# EAGLE design strip (EAGLE 6.4)

## Sheet 1 of 2
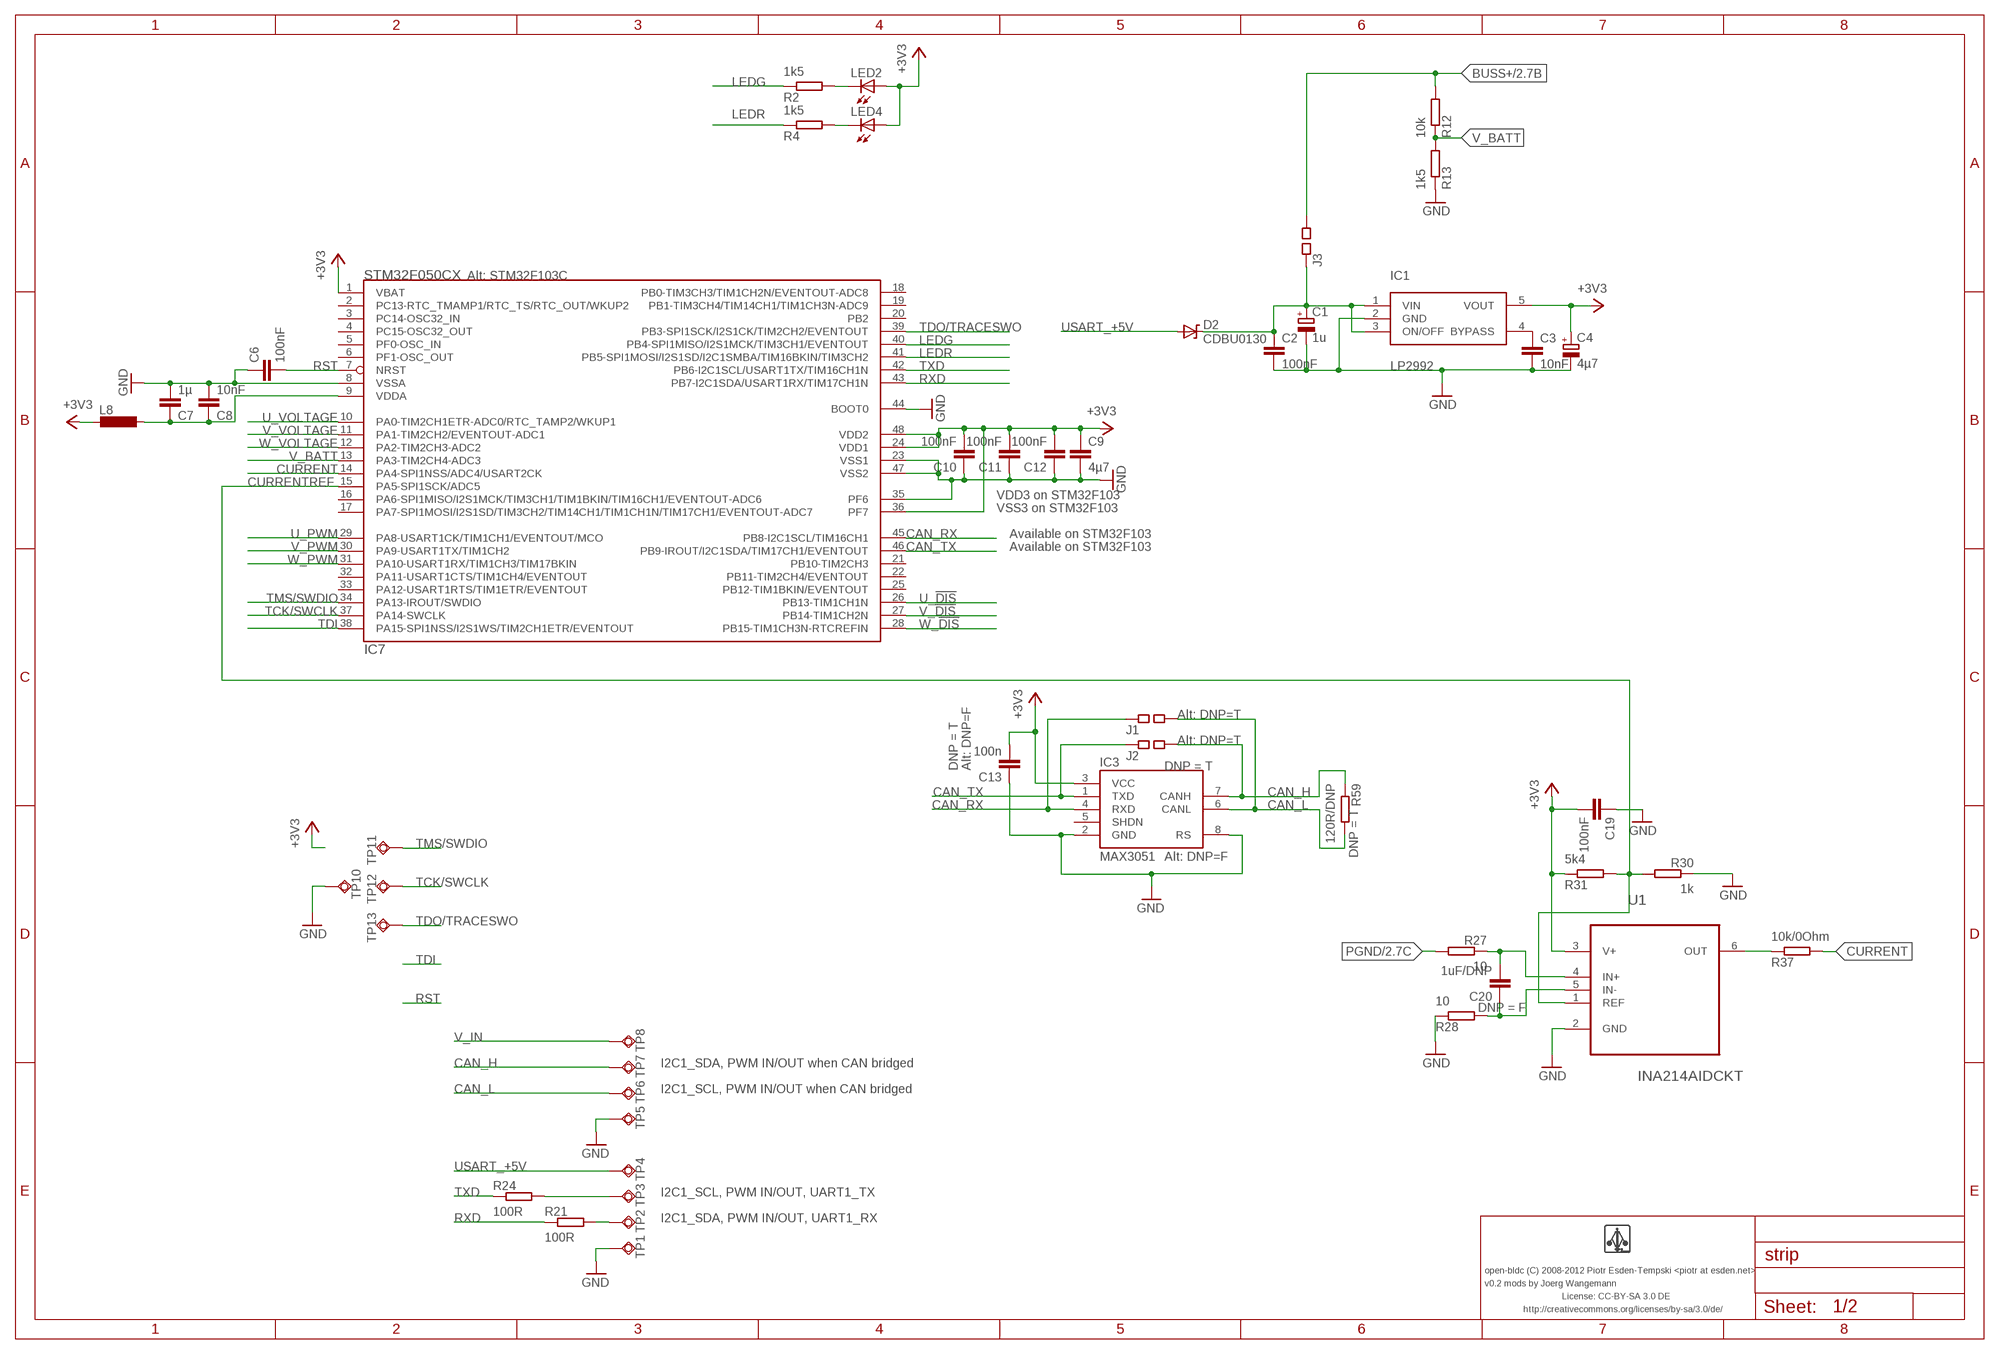
[diagram p0: schematic, sheet 1]

### Parts
C1  1u  CAPACITOR-POL-0805  [0805-POL-CAP]
C2  100nF  CAPACITOR-0402  [0402-CAP]
C3  10nF  CAPACITOR-0402  [0402-CAP]
C4  4µ7  CAPACITOR-POL-0805  [0805-POL-CAP]
C6  100nF  CAPACITOR-0402  [0402-CAP]
C7  1µ  CAPACITOR-0402  [0402-CAP]
C8  10nF  CAPACITOR-0402  [0402-CAP]
C9  4µ7  CAPACITOR-0805  [0805-CAP]
C10  100nF  CAPACITOR-0402  [0402-CAP]
C11  100nF  CAPACITOR-0402  [0402-CAP]
C12  100nF  CAPACITOR-0402  [0402-CAP]
C13  100n  CAPACITOR-0402  [0402-CAP]
C19  100nF  CAPACITOR-0402  [0402-CAP]
C20  1uF/DNP  CAPACITOR-0603  [0603-CAP]
D2  CDBU0130  DIODE-ZENER-0603  [0603-DIO]
IC1  LP2992  [SOT23-5]
IC3  MAX3051  [SO8]
IC7  STM32F050CX  [LQFP48]
J1  SQ_JMP-0402  [0402-SQJMP]
J2  SQ_JMP-0402  [0402-SQJMP]
J3  SQ_JMP-0402  [0402-SQJMP]
L8  INDUCTOR-0603  [0603-IND]
LED2  GREEN  LED-0402  [0402-LED]
LED4  RED  LED-0402  [0402-LED]
R2  1k5  RESISTOR-0402  [0402-RES]
R4  1k5  RESISTOR-0402  [0402-RES]
R12  10k  RESISTOR-0402  [0402-RES]
R13  1k5  RESISTOR-0402  [0402-RES]
R21  100R  RESISTOR-0402  [0402-RES]
R24  100R  RESISTOR-0402  [0402-RES]
R27  10  RESISTOR-0402  [0402-RES]
R28  10  RESISTOR-0402  [0402-RES]
R30  1k  RESISTOR-0402  [0402-RES]
R31  5k4  RESISTOR-0402  [0402-RES]
R37  10k/0Ohm  RESISTOR-0402  [0402-RES]
R59  120R/DNP  RESISTOR-0402  [0402-RES]
TP1  TPSQTP20SQ  [TP20SQ]
TP2  TPSQTP20SQ  [TP20SQ]
TP3  TPSQTP20SQ  [TP20SQ]
TP4  TPSQTP20SQ  [TP20SQ]
TP5  TPSQTP20SQ  [TP20SQ]
TP6  TPSQTP20SQ  [TP20SQ]
TP7  TPSQTP20SQ  [TP20SQ]
TP8  TPSQTP20SQ  [TP20SQ]
TP10  TPSQTP11SQ  [TP11SQ]
TP11  TPSQTP11SQ  [TP11SQ]
TP12  TPSQTP11SQ  [TP11SQ]
TP13  TPSQTP11SQ  [TP11SQ]
U1  INA214AIDCKT  [SOT65P210X110-6N]
U$1  LOGO  LOGO-SILK-SMALL  [LOGO_SILK_SMALL]

### Nets
+3V3: C4.+ C9.P$1 C10.P$2 C11.P$2 C12.P$2 C13.P$2 C19.P$2 IC1.5(VOUT) IC3.3(VCC) IC7.1(VBAT) IC7.24(VDD1) IC7.36(PF7) IC7.48(VDD2) L8.P$2 LED2.A LED4.A R31.P$1 U1.3(V+)
BUSS+: J3.P$2 R12.P$2 ; also sheet 2
CAN_H: IC3.7(CANH) J2.P$2 R59.P$1 TP7.TP
CAN_L: IC3.6(CANL) J1.P$2 R59.P$2 TP6.TP
CAN_RX: IC3.4(RXD) IC7.45(PB8-I2C1SCL/TIM16CH1) J1.P$1
CAN_TX: IC3.1(TXD) IC7.46(PB9-IROUT/I2C1SDA/TIM17CH1/EVENTOUT) J2.P$1
CURRENT: IC7.14(PA4-SPI1NSS/ADC4/USART2CK) R37.P$2
CURRENT_RAW: R37.P$1 U1.6(OUT)
CURRENTREF: IC7.15(PA5-SPI1SCK/ADC5) R30.P$2 R31.P$2 U1.1(REF)
GND: C1.- C2.P$2 C3.P$2 C4.- C6.P$1 C7.P$2 C8.P$2 C9.P$2 C10.P$1 C11.P$1 C12.P$1 C13.P$1 C19.P$1 IC1.2(GND) IC3.2(GND) IC3.8(RS) IC7.8(VSSA) IC7.23(VSS1) IC7.35(PF6) IC7.44(BOOT0) IC7.47(VSS2) R13.P$1 R28.P$1 R30.P$1 TP1.TP TP5.TP TP10.TP U1.2(GND) ; also sheet 2
INA21_INN: C20.P$1 R28.P$2 U1.5(IN-)
INA21_INP: C20.P$2 R27.P$1 U1.4(IN+)
LEDG: IC7.40(PB4-SPI1MISO/I2S1MCK/TIM3CH1/EVENTOUT) R2.P$1
LEDR: IC7.41(PB5-SPI1MOSI/I2S1SD/I2C1SMBA/TIM16BKIN/TIM3CH2) R4.P$1
N$4: LED4.C R4.P$2
N$6: R21.P$2 TP2.TP
N$10: LED2.C R2.P$2
N$20: R24.P$2 TP3.TP
N$22: C3.P$1 IC1.4(BYPASS)
PGND: R27.P$2 ; also sheet 2
RST: C6.P$2 IC7.7(NRST)
RXD: IC7.43(PB7-I2C1SDA/USART1RX/TIM17CH1N) R21.P$1
TCK/SWCLK: IC7.37(PA14-SWCLK) TP12.TP
TDI: IC7.38(PA15-SPI1NSS/I2S1WS/TIM2CH1ETR/EVENTOUT)
TDO/TRACESWO: IC7.39(PB3-SPI1SCK/I2S1CK/TIM2CH2/EVENTOUT) TP13.TP
TMS/SWDIO: IC7.34(PA13-IROUT/SWDIO) TP11.TP
TXD: IC7.42(PB6-I2C1SCL/USART1TX/TIM16CH1N) R24.P$1
U_!DIS: IC7.26(PB13-TIM1CH1N) ; also sheet 2
U_PWM: IC7.29(PA8-USART1CK/TIM1CH1/EVENTOUT/MCO) ; also sheet 2
U_VOLTAGE: IC7.10(PA0-TIM2CH1ETR-ADC0/RTC_TAMP2/WKUP1) ; also sheet 2
USART_+5V: D2.A TP4.TP
V_!DIS: IC7.27(PB14-TIM1CH2N) ; also sheet 2
V_BATT: IC7.13(PA3-TIM2CH4-ADC3) R12.P$1 R13.P$2
V_IN: C1.+ C2.P$1 D2.C IC1.1(VIN) IC1.3(ON/OFF) J3.P$1 TP8.TP
V_PWM: IC7.30(PA9-USART1TX/TIM1CH2) ; also sheet 2
V_VOLTAGE: IC7.11(PA1-TIM2CH2/EVENTOUT-ADC1) ; also sheet 2
VDDA: C7.P$1 C8.P$1 IC7.9(VDDA) L8.P$1
W_!DIS: IC7.28(PB15-TIM1CH3N-RTCREFIN) ; also sheet 2
W_PWM: IC7.31(PA10-USART1RX/TIM1CH3/TIM17BKIN) ; also sheet 2
W_VOLTAGE: IC7.12(PA2-TIM2CH3-ADC2) ; also sheet 2
Unconnected: IC3.5(SHDN) IC7.2(PC13-RTC_TMAMP1/RTC_TS/RTC_OUT/WKUP2) IC7.3(PC14-OSC32_IN) IC7.4(PC15-OSC32_OUT) IC7.5(PF0-OSC_IN) IC7.6(PF1-OSC_OUT) IC7.16(PA6-SPI1MISO/I2S1MCK/TIM3CH1/TIM1BKIN/TIM16CH1/EVENTOUT-ADC6) IC7.17(PA7-SPI1MOSI/I2S1SD/TIM3CH2/TIM14CH1/TIM1CH1N/TIM17CH1/EVENTOUT-ADC7) IC7.18(PB0-TIM3CH3/TIM1CH2N/EVENTOUT-ADC8) IC7.19(PB1-TIM3CH4/TIM14CH1/TIM1CH3N-ADC9) IC7.20(PB2) IC7.21(PB10-TIM2CH3) IC7.22(PB11-TIM2CH4/EVENTOUT) IC7.25(PB12-TIM1BKIN/EVENTOUT) IC7.32(PA11-USART1CTS/TIM1CH4/EVENTOUT) IC7.33(PA12-USART1RTS/TIM1ETR/EVENTOUT)

### Notes on the sheet
- Alt: STM32F103C
- VDD3 on STM32F103
- VSS3 on STM32F103
- Available on STM32F103
- Available on STM32F103
- Alt: DNP=T
- Alt: DNP=T
- Alt: DNP=F
- Alt: DNP=F
- I2C1_SDA, PWM IN/OUT when CAN bridged
- I2C1_SCL, PWM IN/OUT when CAN bridged
- I2C1_SCL, PWM IN/OUT, UART1_TX
- I2C1_SDA, PWM IN/OUT, UART1_RX
- open-bldc (C) 2008-2012 Piotr Esden-Tempski <piotr at esden.net>
- v0.2 mods by Joerg Wangemann
- License: CC-BY-SA 3.0 DE
- http://creativecommons.org/licenses/by-sa/3.0/de/

## Sheet 2 of 2
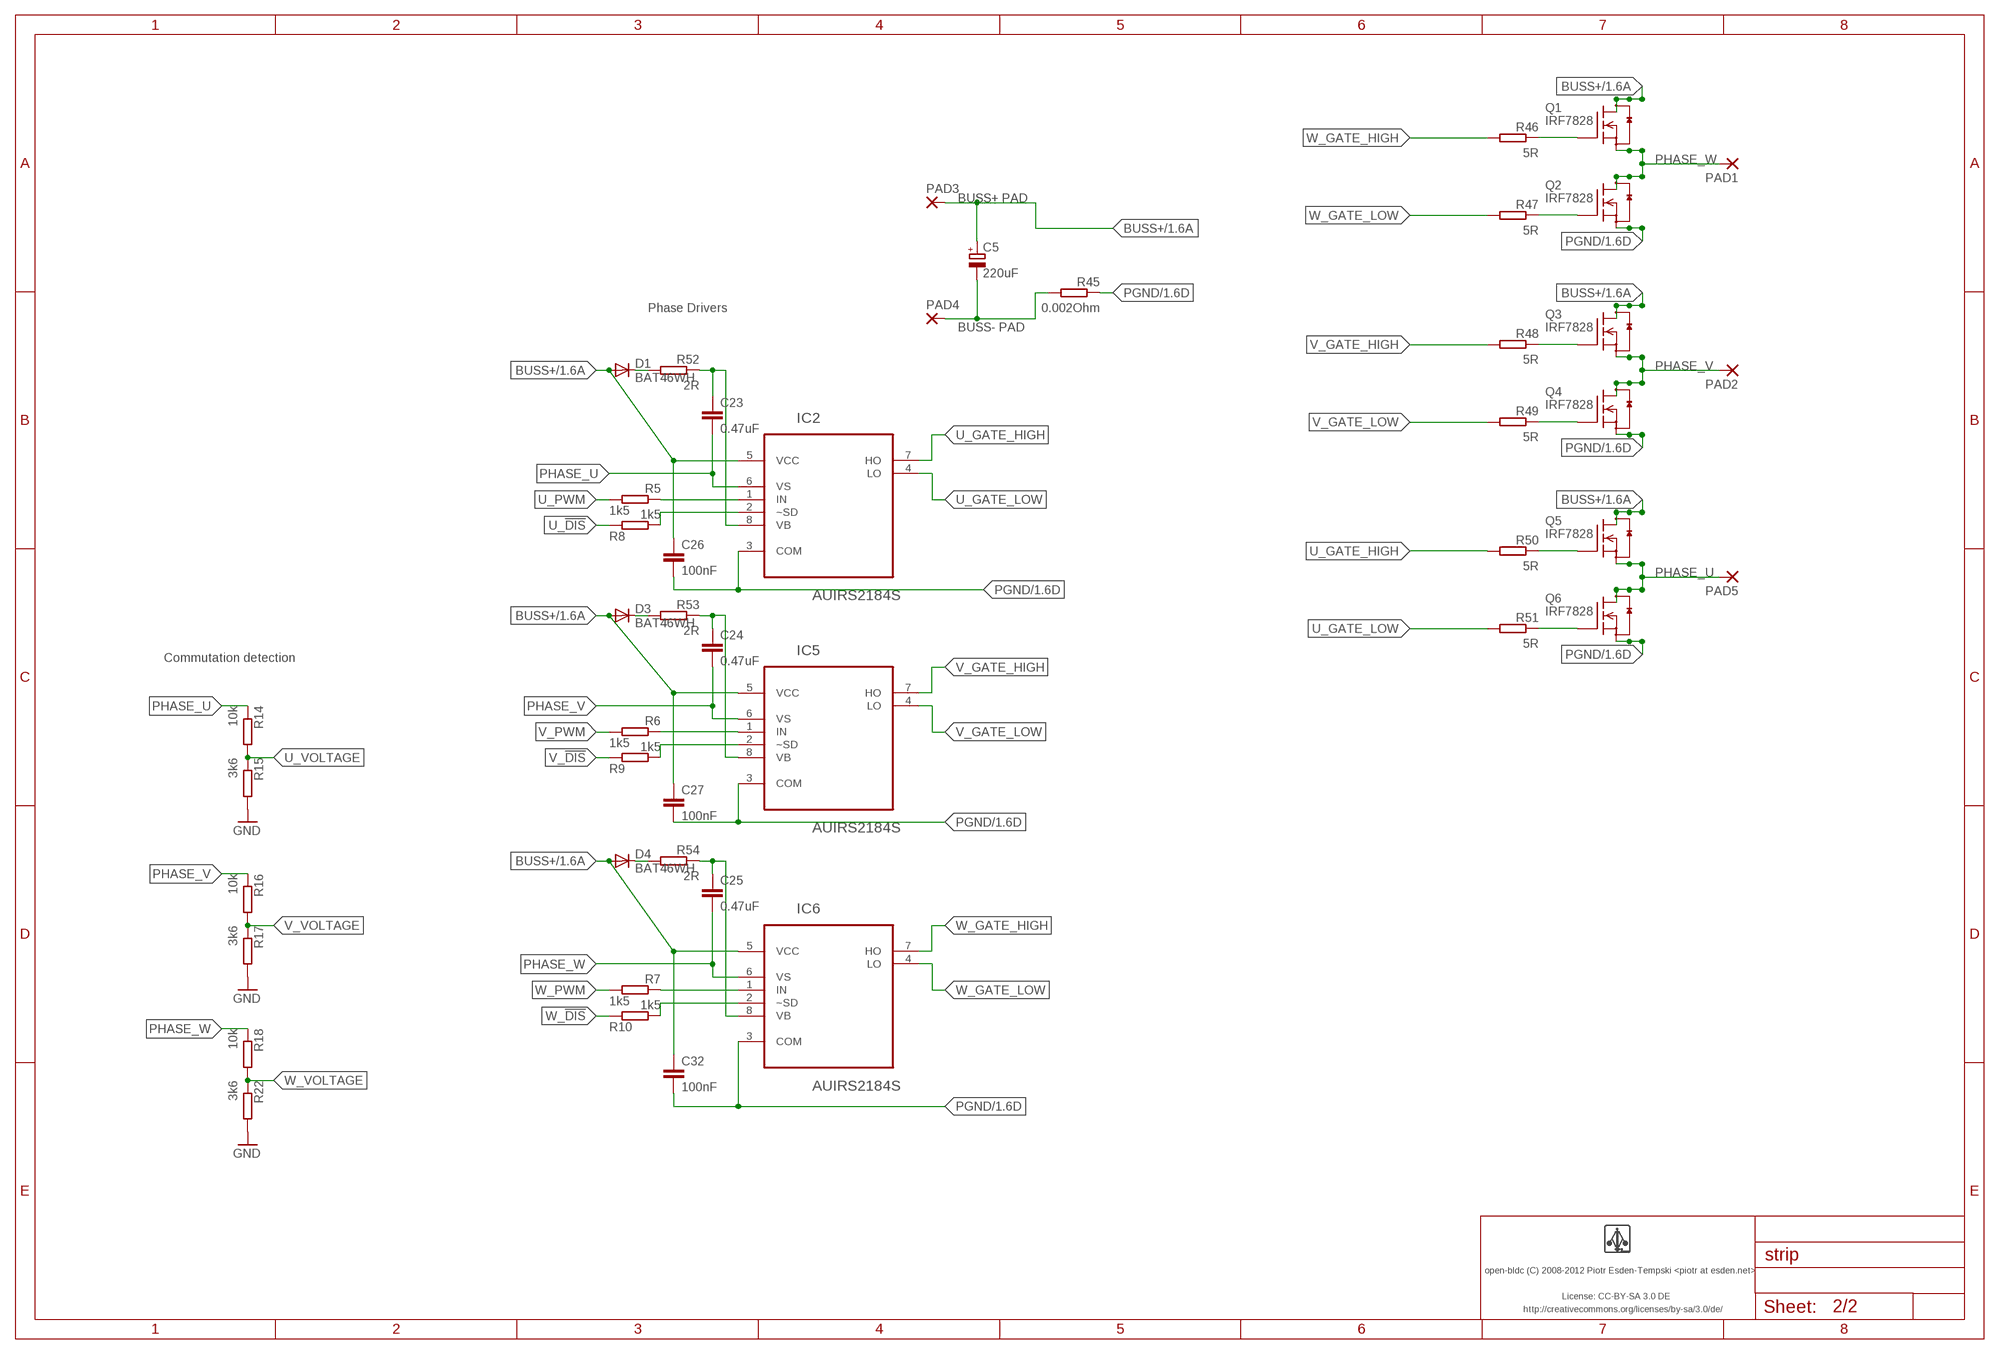
[diagram p1: schematic, sheet 2]

### Parts
C5  220uF  CAPACITOR-POLD  [7343/D]
C23  0.47uF  CAPACITOR-0603  [0603-CAP]
C24  0.47uF  CAPACITOR-0603  [0603-CAP]
C25  0.47uF  CAPACITOR-0603  [0603-CAP]
C26  100nF  CAPACITOR-0603  [0603-CAP]
C27  100nF  CAPACITOR-0603  [0603-CAP]
C32  100nF  CAPACITOR-0603  [0603-CAP]
D1  BAT46WH  DIODE-SOD-123  [SOD-123-DIO]
D3  BAT46WH  DIODE-SOD-123  [SOD-123-DIO]
D4  BAT46WH  DIODE-SOD-123  [SOD-123-DIO]
IC2  AUIRS2184S  [SOIC127P600X175-8N]
IC5  AUIRS2184S  [SOIC127P600X175-8N]
IC6  AUIRS2184S  [SOIC127P600X175-8N]
PAD1  SMD5  [SMD2,54-5,08]
PAD2  SMD5  [SMD2,54-5,08]
PAD3  SMD5  [SMD2,54-5,08]
PAD4  SMD5  [SMD2,54-5,08]
PAD5  SMD5  [SMD2,54-5,08]
Q1  IRF7828  [SO8]
Q2  IRF7828  [SO8]
Q3  IRF7828  [SO8]
Q4  IRF7828  [SO8]
Q5  IRF7828  [SO8]
Q6  IRF7828  [SO8]
R5  1k5  RESISTOR-0402  [0402-RES]
R6  1k5  RESISTOR-0402  [0402-RES]
R7  1k5  RESISTOR-0402  [0402-RES]
R8  1k5  RESISTOR-0402  [0402-RES]
R9  1k5  RESISTOR-0402  [0402-RES]
R10  1k5  RESISTOR-0402  [0402-RES]
R14  10k  RESISTOR-0402  [0402-RES]
R15  3k6  RESISTOR-0402  [0402-RES]
R16  10k  RESISTOR-0402  [0402-RES]
R17  3k6  RESISTOR-0402  [0402-RES]
R18  10k  RESISTOR-0402  [0402-RES]
R22  3k6  RESISTOR-0402  [0402-RES]
R45  0.002Ohm  RESISTOR-1206  [1206-RES]
R46  5R  RESISTOR-0603  [0603-RES]
R47  5R  RESISTOR-0603  [0603-RES]
R48  5R  RESISTOR-0603  [0603-RES]
R49  5R  RESISTOR-0603  [0603-RES]
R50  5R  RESISTOR-0603  [0603-RES]
R51  5R  RESISTOR-0603  [0603-RES]
R52  2R  RESISTOR-0402  [0402-RES]
R53  2R  RESISTOR-0402  [0402-RES]
R54  2R  RESISTOR-0402  [0402-RES]
U$2  LOGO  LOGO-SILK-SMALL  [LOGO_SILK_SMALL]

### Nets
BUSS+: C5.+ C26.P$1 C27.P$1 C32.P$1 D1.A D3.A D4.A IC2.5(VCC) IC5.5(VCC) IC6.5(VCC) PAD3.1(P) Q1.5(D1) Q1.6(D2) Q1.7(D3) Q1.8(D4) Q3.5(D1) Q3.6(D2) Q3.7(D3) Q3.8(D4) Q5.5(D1) Q5.6(D2) Q5.7(D3) Q5.8(D4) ; also sheet 1
GND: C5.- PAD4.1(P) R15.P$2 R17.P$2 R22.P$2 R45.P$2 ; also sheet 1
N$1: D1.C R52.P$2
N$2: D4.C R54.P$2
N$3: D3.C R53.P$2
PGND: C26.P$2 C27.P$2 C32.P$2 IC2.3(COM) IC5.3(COM) IC6.3(COM) Q2.1(S3) Q2.2(S2) Q2.3(S1) Q4.1(S3) Q4.2(S2) Q4.3(S1) Q6.1(S3) Q6.2(S2) Q6.3(S1) R45.P$1 ; also sheet 1
PHASE_U: C23.P$2 IC2.6(VS) PAD5.1(P) Q5.1(S3) Q5.2(S2) Q5.3(S1) Q6.5(D1) Q6.6(D2) Q6.7(D3) Q6.8(D4) R14.P$1
PHASE_V: C24.P$2 IC5.6(VS) PAD2.1(P) Q3.1(S3) Q3.2(S2) Q3.3(S1) Q4.5(D1) Q4.6(D2) Q4.7(D3) Q4.8(D4) R16.P$1
PHASE_W: C25.P$2 IC6.6(VS) PAD1.1(P) Q1.1(S3) Q1.2(S2) Q1.3(S1) Q2.5(D1) Q2.6(D2) Q2.7(D3) Q2.8(D4) R18.P$1
U_!DIS: R8.P$1 ; also sheet 1
U_GATE_HIGH: IC2.7(HO) R50.P$2
U_GATE_HIGH_T: Q5.4(G) R50.P$1
U_GATE_LOW: IC2.4(LO) R51.P$2
U_GATE_LOW_T: Q6.4(G) R51.P$1
U_PWM: R5.P$2 ; also sheet 1
U_PWM_IN: IC2.1(IN) R5.P$1
U_SD: IC2.2(~SD) R8.P$2
U_VB: C23.P$1 IC2.8(VB) R52.P$1
U_VOLTAGE: R14.P$2 R15.P$1 ; also sheet 1
V_!DIS: R9.P$1 ; also sheet 1
V_GATE_HIGH: IC5.7(HO) R48.P$2
V_GATE_HIGH_T: Q3.4(G) R48.P$1
V_GATE_LOW: IC5.4(LO) R49.P$2
V_GATE_LOW_T: Q4.4(G) R49.P$1
V_PWM: R6.P$2 ; also sheet 1
V_PWM_IN: IC5.1(IN) R6.P$1
V_SD: IC5.2(~SD) R9.P$2
V_VB: C24.P$1 IC5.8(VB) R53.P$1
V_VOLTAGE: R16.P$2 R17.P$1 ; also sheet 1
W_!DIS: R10.P$1 ; also sheet 1
W_GATE_HIGH: IC6.7(HO) R46.P$2
W_GATE_HIGH_T: Q1.4(G) R46.P$1
W_GATE_LOW: IC6.4(LO) R47.P$2
W_GATE_LOW_T: Q2.4(G) R47.P$1
W_PWM: R7.P$2 ; also sheet 1
W_PWM_IN: IC6.1(IN) R7.P$1
W_SD: IC6.2(~SD) R10.P$2
W_VB: C25.P$1 IC6.8(VB) R54.P$1
W_VOLTAGE: R18.P$2 R22.P$1 ; also sheet 1

### Notes on the sheet
- BUSS+ PAD
- Phase Drivers
- BUSS- PAD
- Commutation detection
- open-bldc (C) 2008-2012 Piotr Esden-Tempski <piotr at esden.net>
- License: CC-BY-SA 3.0 DE
- http://creativecommons.org/licenses/by-sa/3.0/de/

## Library data of the parts
C1 = pel_dipol_comp:CAPACITOR-POL; PARTNO: cap-cer-0805-1u-35v
C2 C6 C10-C12 C19 C26 C27 C32 = pel_dipol_comp:CAPACITOR; PARTNO: cap-cer-0402-100n
C3 C8 = pel_dipol_comp:CAPACITOR; PARTNO: cap-cer-0402-10n
C4 = pel_dipol_comp:CAPACITOR-POL; PARTNO: cap-cer-0805-4u7-16v
C5 = pel_dipol_comp:CAPACITOR-POL; PARTNO: cap-tan-D-220u-16v
C7 = pel_dipol_comp:CAPACITOR; PARTNO: cap-cer-0402-1u
C9 = pel_dipol_comp:CAPACITOR; PARTNO: cap-cer-0805-4u7
C13 = pel_dipol_comp:CAPACITOR; DNP: T; PARTNO: cap-cer-0402-100n
C20 = pel_dipol_comp:CAPACITOR; DNP: F; PARTNO: cap-cer-0402-100n
C23-C25 = pel_dipol_comp:CAPACITOR; PARTNO: cap-tan-0603-1u
D1 D3 D4 = pel_dipol_comp:DIODE; PARTNO: *
D2 = pel_dipol_comp:DIODE-ZENER; PARTNO: diode-0603
IC1 = open-bldc:LP2992; PARTNO: vreg-sot-23-5-3v3
IC2 IC5 IC6 = auris2184s:AUIRS2184S: HALF-BRIDGE DRIVER; MPN: AUIRS2184S; OC_FARNELL: 1866062; OC_NEWARK: 39T4040; PACKAGE: SOIC-8; PARTNO: ic-so8-mosfet-driver-buck; SUPPLIER: INTERNATIONAL RECTIFIER
IC3 = open-bldc:MAX3051; DNP: T; PARTNO: *
IC7 = pel_stm32:STM32F050CX; PARTNO: mcu-tqfp-32-stm32f05
J1-J3 = pel_jumpers:SQ_JMP; PARTNO: res-0402-0
L8 = res_cap:INDUCTOR; PARTNO: ferrite-0603-600ohm
LED2 LED4 = pel_dipol_comp:LED; PARTNO: led-0402-green
PAD1-PAD5 = wirepad:SMD5: SMD PAD; PARTNO: *
Q1-Q6 = open-bldc:IRF7828; PARTNO: ic-so8-mosfet-n-ch-30v-15a
R2 R4-R10 R13 = pel_dipol_comp:RESISTOR; PARTNO: res-0402-1k5
R12 R14 R16 R18 = pel_dipol_comp:RESISTOR; PARTNO: res-0402-10k
R15 R17 R22 = pel_dipol_comp:RESISTOR; PARTNO: *
R21 R24 = pel_dipol_comp:RESISTOR; PARTNO: res-0402-100
R27 = pel_dipol_comp:RESISTOR; PARTNO: res-0402-665
R28 = pel_dipol_comp:RESISTOR; PARTNO: res-0402-560
R30 = pel_dipol_comp:RESISTOR; PARTNO: res-0402-1k
R31 = pel_dipol_comp:RESISTOR; PARTNO: res-0402-5k36
R37 = pel_dipol_comp:RESISTOR; PARTNO: res-0402-0
R45 = pel_dipol_comp:RESISTOR; PARTNO: res-1206-0005
R46-R54 = pel_dipol_comp:RESISTOR; PARTNO: res-0402-10
R59 = pel_dipol_comp:RESISTOR; DNP: T; PARTNO: res-0402-60.4
TP1-TP8 TP10-TP13 = testpad:TPSQ: Test pad; DNP: T; PARTNO: *
U1 = open-bldc:INA214AIDCKT: CURRENT SHUNT MONITOR; MPN: INA214AIDCKT; OC_FARNELL: 1754262; OC_NEWARK: 05N1041; PACKAGE: SC-70-6; SUPPLIER: Texas Instruments
U$1 U$2 = open-bldc:LOGO; PARTNO: *

## Board
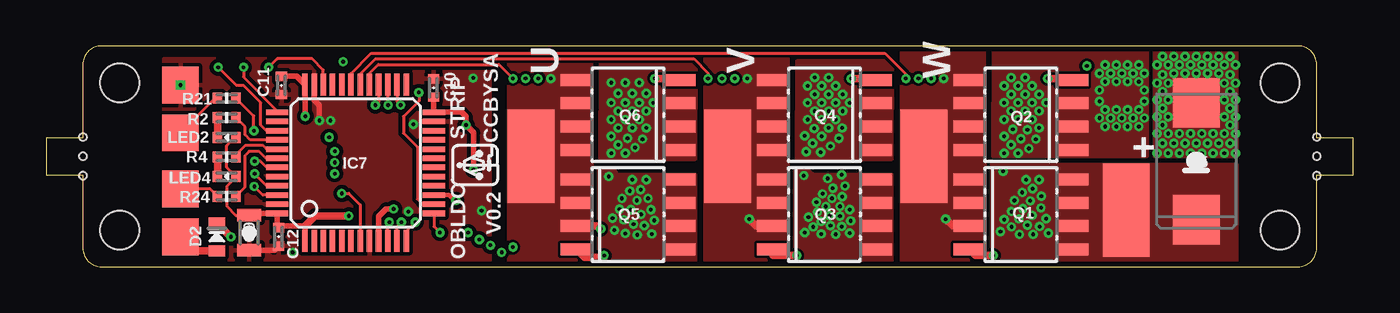
[diagram p2: board, top side]
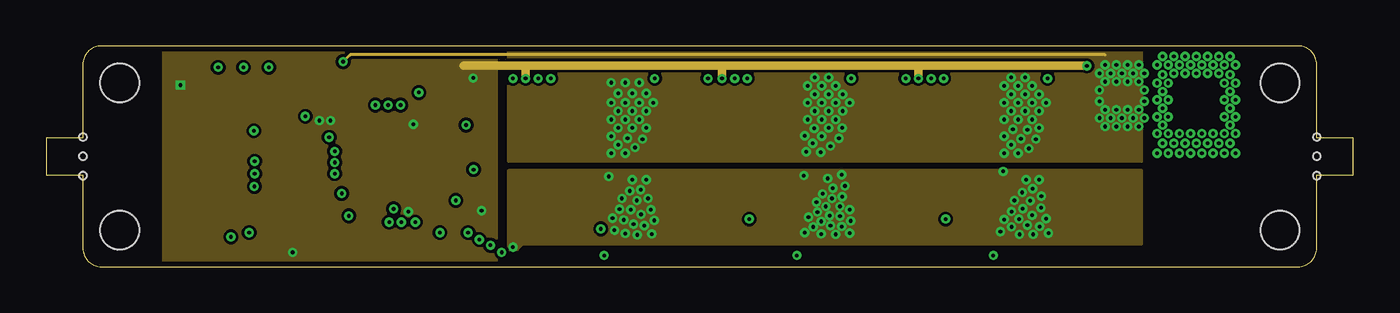
[diagram p3: board, inner layer Route2]
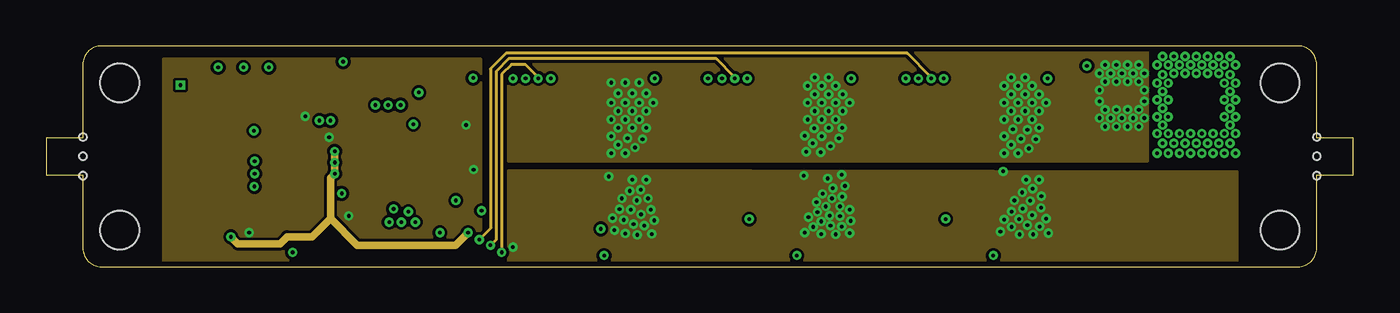
[diagram p4: board, inner layer Route15]
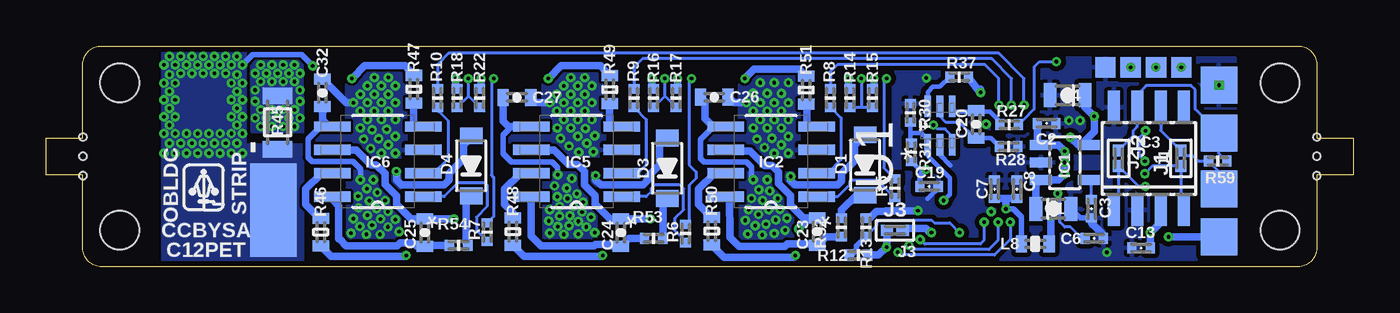
[diagram p5: board, bottom side, seen from below]

Size 71 x 12 mm. Coordinates in mm from the lower left corner, seen from the top.
Outline: 2,1 arc90 3,0 68,0 arc90 69,1 69,5 71,5 71,7 69,7 69,11 arc90 68,12 3,12 arc90 2,11 2,7 0,7 0,5 2,5 2,1
Copper layers (1+2*15+16): Top 0.035mm / dielectric 0.36mm / Route2 0.035mm / dielectric 0.71mm / Route15 0.035mm / dielectric 0.36mm / Bottom 0.035mm
Design rules "LeitOn - Standard-Eagle-DRU - 4-Lagen Multilayer - deutsch - Rev 2.0 *": minimum track width 0.15mm, minimum drill 0.2mm, track to track 0.15mm, track to pad 0.15mm, pad to pad 0.15mm, via to via 0.15mm, smd to smd 0.15mm, copper to edge 0.3mm, drill to drill 0.3mm, minimum pad ring 0.15mm, minimum via ring 0.15mm, stop-mask expansion 0.075mm, vias tented up to drill 0mil, thermal gap 0.2mm
Holes 2.1 mm at 67,2 4,10 67,10 4,2
Holes 0.4 mm at 69,6 69,7.05 69,4.95 2,4.95 2,6 2,7.05
bRestrict: area 29.6,21.1 to 29.9,21.1; area 25.8,21 to 26.1,21

### Footprints (pad centres in the part's own frame; a part is rotated, then mirrored left to right if it is on the bottom)
0805-POL-CAP = smd 0.7 x 1.3: + -0.95,0; - 0.95,0
0402-CAP = smd 0.5 x 0.6: P$1 -0.5,0; P$2 0.5,0
7343/D = smd 2.7 x 2.55: + -3.175,0; - 3.175,0
0805-CAP = smd 0.7 x 1.3: P$1 -0.95,0; P$2 0.95,0
0603-CAP = smd 0.6 x 0.9: P$1 -0.75,0; P$2 0.75,0
SOD-123-DIO = smd 0.91 x 1.22: A 1.64,0; C -1.64,0
0603-DIO = smd 0.6 x 0.9: A 0.75,0; C -0.75,0
SOT23-5 = smd 0.55 x 1.2: 1 -0.95,-1.3; 2 0,-1.3; 3 0.95,-1.3; 4 0.95,1.3; 5 -0.95,1.3
SOIC127P600X175-8N = smd 1.981 x 0.559: 1 -2.464,1.905; 2 -2.464,0.635; 3 -2.464,-0.635; 4 -2.464,-1.905; 5 2.464,-1.905; 6 2.464,-0.635; 7 2.464,0.635; 8 2.464,1.905
SO8 = smd 0.65 x 1.75: 1 -1.905,-2.8; 2 -0.635,-2.8; 3 0.635,-2.8; 4 1.905,-2.8; 5 1.905,2.8; 6 0.635,2.8; 7 -0.635,2.8; 8 -1.905,2.8
LQFP48 = smd 0.3 x 1.2: 1 -2.75,-4.25; 2 -2.25,-4.25; 3 -1.75,-4.25; 4 -1.25,-4.25; 5 -0.75,-4.25; 6 -0.25,-4.25; 7 0.25,-4.25; 8 0.75,-4.25; 9 1.25,-4.25; 10 1.75,-4.25; 11 2.25,-4.25; 12 2.75,-4.25; 25 2.75,4.25; 26 2.25,4.25; 27 1.75,4.25; 28 1.25,4.25; 29 0.75,4.25; 30 0.25,4.25; 31 -0.25,4.25; 32 -0.75,4.25; 33 -1.25,4.25; 34 -1.75,4.25; 35 -2.25,4.25; 36 -2.75,4.25 | smd 1.2 x 0.3: 13 4.25,-2.75; 14 4.25,-2.25; 15 4.25,-1.75; 16 4.25,-1.25; 17 4.25,-0.75; 18 4.25,-0.25; 19 4.25,0.25; 20 4.25,0.75; 21 4.25,1.25; 22 4.25,1.75; 23 4.25,2.25; 24 4.25,2.75; 37 -4.25,2.75; 38 -4.25,2.25; 39 -4.25,1.75; 40 -4.25,1.25; 41 -4.25,0.75; 42 -4.25,0.25; 43 -4.25,-0.25; 44 -4.25,-0.75; 45 -4.25,-1.25; 46 -4.25,-1.75; 47 -4.25,-2.25; 48 -4.25,-2.75
0402-SQJMP = smd 0.652 x 0.6: P$1 -0.424,0; P$2 0.424,0
0603-IND = smd 0.6 x 0.9: P$1 -0.75,0; P$2 0.75,0
0402-LED = smd 0.5 x 0.6: A 0.5,0; C -0.5,0
SMD2,54-5,08 = smd 2.54 x 5.08: 1 0,0
0402-RES = smd 0.5 x 0.6: P$1 -0.5,0; P$2 0.5,0
1206-RES = smd 0.9 x 1.6: P$1 -1.45,0; P$2 1.45,0
0603-RES = smd 0.6 x 0.9: P$1 -0.75,0; P$2 0.75,0
TP20SQ = smd 2 x 2: TP 0,0
TP11SQ = smd 1.1 x 1.1: TP 0,0
SOT65P210X110-6N = smd 1.168 x 0.356: 1 -1.041,0.66; 2 -1.041,0; 3 -1.041,-0.66; 4 1.041,-0.66; 5 1.041,0; 6 1.041,0.66

### Placement (x,y rotation side)
C1  16.29,3.15 0 bottom
C2  16.67,7.79 0 bottom
C3  14.23,3.15 270 bottom
C4  15.53,9.32 180 bottom
C5  62.46,5.74 90 top
C6  14.08,1.55 180 bottom
C7  19.49,4.21 90 bottom
C8  18.27,4.21 90 bottom
C9  11.03,1.85 270 top
C10  21.04,9.72 270 top
C11  12.78,9.85 90 top
C12  12.63,1.62 90 top
C13  11.54,1.01 0 bottom
C19  23.05,4.37 180 bottom
C20  20.5,7.75 90 bottom
C23  29.11,1.91 90 bottom
C24  39.78,1.86 90 bottom
C25  50.42,1.86 90 bottom
C26  34.71,9.22 0 bottom
C27  45.42,9.19 0 bottom
C32  55.99,9.44 90 bottom
D1  26.52,5.53 90 bottom
D2  9.28,1.62 270 top
D3  37.27,5.36 90 bottom
D4  47.91,5.48 90 bottom
IC1  15.68,5.66 270 bottom
IC2  31.62,5.71 180 bottom
IC3  11.11,5.89 0 bottom
IC5  42.19,5.71 180 bottom
IC6  52.99,5.71 180 bottom
IC7  16.81,5.65 0 top
J1  9.38,5.89 90 bottom
J2  12.76,5.89 90 bottom
J3  24.9,1.98 180 bottom
L8  17.28,1.24 0 bottom
LED2  9.81,7.03 0 top
LED4  9.81,4.9 0 top
PAD1  47.68,6 180 top
PAD2  37.01,6 180 top
PAD3  58.65,3.07 180 top
PAD4  58.65,3.07 0 bottom
PAD5  26.35,6 180 top
Q1  52.94,2.84 270 top
Q2  52.94,8.25 90 top
Q3  42.27,2.84 270 top
Q4  42.27,8.25 90 top
Q5  31.6,2.84 270 top
Q6  31.6,8.25 90 top
R2  9.81,8.1 180 top
R4  9.81,5.96 180 top
R5  24.9,4.26 90 bottom
R6  36.27,1.8 90 bottom
R7  47.04,1.88 90 bottom
R8  28.4,9.17 270 bottom
R9  39.07,9.17 270 bottom
R10  49.74,9.17 270 bottom
R12  26.88,0.63 0 bottom
R13  26.47,2.13 270 bottom
R14  27.34,9.17 270 bottom
R15  26.12,9.17 90 bottom
R16  38,9.17 270 bottom
R17  36.78,9.17 90 bottom
R18  48.67,9.17 270 bottom
R21  9.81,9.17 180 top
R22  47.45,9.17 90 bottom
R24  9.81,3.83 180 top
R27  18.7,7.72 0 bottom
R28  18.73,6.52 180 bottom
R30  24.06,8.36 270 bottom
R31  24.01,6.22 90 bottom
R37  21.42,10.31 0 bottom
R45  58.43,7.84 270 bottom
R46  56.08,1.88 90 bottom
R47  51.03,9.65 270 bottom
R48  45.65,1.91 90 bottom
R49  40.39,9.63 270 bottom
R50  34.85,1.93 90 bottom
R51  29.72,9.6 270 bottom
R52  27.79,2.13 90 bottom
R53  38,1.55 0 bottom
R54  48.6,1.17 0 bottom
R59  7.37,5.74 180 bottom
TP1  7.3,9.88 0 top
TP2  7.3,7.28 0 top
TP3  7.3,4.22 0 top
TP4  7.3,1.62 0 top
TP5  7.3,9.88 0 bottom
TP6  7.3,4.23 0 bottom
TP7  7.3,7.27 0 bottom
TP8  7.3,1.62 0 bottom
TP10  13.47,10.84 0 bottom
TP11  12.1,10.84 0 bottom
TP12  10.72,10.84 0 bottom
TP13  9.35,10.84 0 bottom
U1  22.46,7.67 90 bottom
U$1  62.44,4.47 0 bottom
U$2  23.14,5.52 90 top

### Tracks (layer width: path | path; a pad name or v marks a point on that pad's centre or on a via)
+3V3  (via drill 0.2)
  Top 0.152: LED2.A 10.27,7.03 9.81,6.58 9.81,5.4 LED4.A 10.31,4.87 9.81,4.37 9.81,3.3 10.31,2.8 C9.P$1
  Top 0.305: C11.P$2 13.61,10.35 IC7.36 14.06,8.19 v14.08,8.18 | C10.P$2 21.04,8.42 IC7.24 22.58,8.4 22.82,8.16 v22.82,7.7 23.22,7.29 v23.22,5.28 | IC7.1 14.06,2.21 12.72,2.21 C12.P$2 12.56,2.19 IC7.48 11.13,2.9 C9.P$1
  Top 0.406: 14.06,2.21 14.61,2.77 v16.44,2.77
  Bottom 0.152: U1.3 21.8,7.11 22.18,7.49 22.61,7.49 v22.82,7.7
  Bottom 0.254: R31.P$1 23.57,5.28 v23.22,5.28
  Bottom 0.305: v23.22,5.28 23.55,4.95 C19.P$2
  Bottom 0.406: 14.57,9.28 C4.+ 14.57,8.67 v14.08,8.18 14.08,7.34 14.84,6.58 | IC1.5 14.95,6.61 v15.37,7.03 | L8.P$2 16.44,1.33 v16.44,2.77 | IC3.3 10.47,2.41 v11.03,1.85 v11.04,1.84 C13.P$2
  pour Route15: 6.38,11.3 23.6,11.3 23.6,0.25 6.38,0.25
BUSS+  (via drill 0.2)
  Bottom 0.305: v43.21,5 43.21,5.38 43.52,5.69 45.73,5.69 46.18,6.15 46.18,7.16 45.73,7.62 | 45.01,7.62 IC5.5 | v32.59,4.72 32.7,4.83 32.7,5.41 32.98,5.69 35.26,5.69 35.46,5.89 35.46,6.91 34.78,7.59 34.78,7.62 | IC6.5 56.09,7.62 56.77,6.93 56.77,5.94 56.55,5.71 54.34,5.71 53.93,5.31 v53.93,4.72
  Bottom 0.406: J3.P$2 25.33,1.09 v25.36,1.06 25.79,0.63 R12.P$2 | IC5.5 45.73,7.62 45.87,7.62 46.17,7.92 C27.P$1 | IC2.5 34.78,7.62 35.21,8.05 35.21,8.06 35.21,8.97 C26.P$1 | C32.P$1 55.99,7.98 55.63,7.62 IC6.5 | v51.97,5.18 51.97,4.72 51.7,4.45 49.38,4.45 49.1,4.72 49.1,5.08 48.32,5.87 48.32,6.6 47.91,7.01 D4.A | v41.15,4.95 41.15,4.72 40.87,4.45 38.59,4.45 38.33,4.7 38.33,4.88 37.67,5.54 37.67,6.59 D3.A | v30.56,4.9 30.56,4.7 30.31,4.45 28.02,4.45 27.79,4.67 27.79,5.05 27.11,5.74 27.11,6.59 D1.A
  other vias: 31.37,2.54 30.77,2.64 32.29,4.19 31.7,4.11 31.15,3.12 30.87,1.98 32.85,3.1 32.31,2.84 31.91,2.31 32.7,3.71 31.27,3.71 33.03,2.51 32.49,2.24 31.45,1.8 32.11,1.73 32.9,1.78 32.09,3.61 31.76,3.1 42.35,3.28 41.41,2.69 42.73,4.27 42.68,3.71 41.66,2.16 43.39,4.39 43.11,3.28 43.11,2.74 42.6,2.24 43.24,3.81 43.69,2.49 43.21,2.18 41.2,1.85 42.09,1.78 42.88,1.75 43.64,1.83 43.64,3.1 42.17,3.96 41.84,3.51 54.03,3.2 52.84,2.59 52.02,2.57 53.57,4.24 53.45,3.58 53.04,3.15 52.43,2.16 53.02,4.04 52.43,3 53.55,2.79 53.29,2.26 54.31,2.62 53.96,2.18 51.82,1.91 52.86,1.75 53.6,1.75 54.44,1.83 52.58,3.61 54.06,3.84 53.22,4.72 42.45,4.8 31.83,4.72 41.89,2.97 42.55,2.77 42.09,2.46
  pour Route2: 25.13,5.26 59.49,5.26 59.49,1.22 25.89,1.22 25.58,0.91 25.13,0.91
  pour Top (no thermals): 30,5.3 30.84,5.3 31.02,5.05 35.26,5.05 35.26,0.02 30,0.02
  pour Route15: 25.13,5.26 64.67,5.18 64.67,-0.08 25.13,-0.08
  pour Top (no thermals): 40.67,5.33 41.31,5.33 41.64,5.05 45.93,5.05 45.93,0.02 40.67,0.02
  pour Top (no thermals): 51.34,5.58 64.67,5.58 64.67,0.02 51.34,0.02
  pour Bottom: 30.46,1.24 33.28,1.24 33.28,5.13 30.46,5.13
  pour Bottom: 41.13,1.24 43.95,1.24 43.95,5.13 41.13,5.13
  pour Bottom: 51.8,1.32 54.62,1.32 54.62,5.2 51.8,5.2
CAN_H
  Bottom 0.152: J2.P$2 11.94,7.12 11.94,7.41 11.74,7.62 IC3.7 11.74,9.37 11.26,9.85 8.82,9.85 8.59,9.62 8.59,8.56 TP7.TP 7.3,6.16 R59.P$1
CAN_L
  Bottom 0.152: IC3.6 10.47,7.41 J1.P$2 9.11,6.04 8.74,6.04 8.44,5.74 R59.P$2 7.3,5.16 TP6.TP
CAN_RX  (via drill 0.2)
  Top 0.152: IC7.45 11.99,4.4 v11.33,5.05
  Bottom 0.152: v11.33,5.05 10.92,5.46 J1.P$1 9.38,3.27 IC3.4
CAN_TX  (via drill 0.2)
  Top 0.152: IC7.46 11.78,3.9 v11.31,4.37
  Bottom 0.152: v11.31,4.37 11.66,4.37 J2.P$1 12.76,3.34 IC3.1
CURRENT  (via drill 0.2)
  Top 0.152: v20.25,9.47 20.25,9.01 19.41,8.18 19.41,7.26 20.17,6.5 20.17,3.68 20.46,3.4 IC7.14
  Bottom 0.406: R37.P$2 20.25,9.43 v20.25,9.47 20.25,9.66
CURRENT_RAW
  Bottom 0.254: U1.6 23.12,9.5 22.84,9.78 22.45,9.78 R37.P$1
CURRENTREF  (via drill 0.2)
  Top 0.254: IC7.15 21.88,3.9 22.18,3.61 v22.26,3.61
  Bottom 0.254: R30.P$2 24.06,7.26 | 24.06,7.26 24.06,6.77 R31.P$2 | 24.06,7.26 23.48,7.26 23.12,6.91 U1.1 23.12,6.02 21.93,4.83 21.93,3.94 v22.26,3.61
GND  (via drill 0.2)
  Top 0.305: IC7.35 14.56,9.06 14.84,8.78 v14.84,7.95 | C12.P$1 12.41,0.9 C9.P$2
  Route2 0.457: v56.52,10.92 47.38,10.92 | 47.38,10.92 36.71,10.92 | 36.71,10.92 26.04,10.92 | 26.04,10.92 22.69,10.92 | v47.38,10.23 47.38,10.92 | v36.71,10.23 36.71,10.92 | v26.04,10.23 26.04,10.92
  Bottom 0.152: PAD4.1 58.27,5.43
  Bottom 0.254: C19.P$1 22.55,4.28 23.14,3.68 | U1.2 22.46,6.1 21.88,5.51
  Bottom 0.305: v56.52,10.92 57.13,11.53 59.78,11.53 v60.33,10.97 | C3.P$2 14.84,2.65 C1.-
  Bottom 0.406: R15.P$2 26.04,9.74 v26.04,10.23 | R17.P$2 36.71,9.74 v36.71,10.23 | R22.P$2 47.38,9.74 v47.38,10.23 | C6.P$1 13.58,1.73 14.23,2.38 C3.P$2 | R13.P$1 26.28,2.63 25.91,3 25.46,3 25.41,3.04 v23.65,3.04
  other vias: 7.3,9.88 13.39,0.78 19.94,7.74 23.2,10.26 15.45,7.95 19.68,2.99 60.94,6.17 61.55,6.17 60.33,6.17 62.16,6.17 62.77,6.17 63.38,6.17 63.99,6.17 64.6,6.17 61.24,6.71 61.85,6.71 60.64,6.71 62.46,6.71 63.07,6.71 63.68,6.71 64.29,6.71 60.94,7.24 61.55,7.24 60.33,7.24 62.16,7.24 62.77,7.24 63.38,7.24 63.99,7.24 64.6,7.24 60.33,8.15 60.64,7.7 60.64,8.61 60.94,8.15 60.33,9.07 60.94,9.07 64.29,7.7 64.6,8.15 63.99,8.15 64.29,8.61 63.99,9.07 64.6,9.07 60.64,9.53 60.94,9.98 60.64,10.44 60.33,9.98 60.94,10.97 64.29,9.53 64.6,9.98 64.29,10.44 63.99,9.98 63.99,10.97 63.68,10.52 61.24,10.52 61.85,10.52 62.46,10.52 63.07,10.52 61.55,10.97 62.16,10.97 62.77,10.97 63.38,10.97 64.6,10.97 61.24,11.43 60.64,11.43 64.29,11.43 61.85,11.43 62.46,11.43 63.07,11.43 63.68,11.43
  pour Top (isolate 0.203, rank 6): 6.38,0.25 6.38,11.33 24.11,11.33 24.11,0.25
  pour Bottom (isolate 0.254, rank 6): 6.38,0.25 6.38,11.33 25.02,11.33 25.02,0.25
  pour Route2: 6.38,11.98 24.44,11.98 24.44,0.02 6.38,0.02
  pour Bottom (no thermals): 57.05,0.02 64.67,0.02 64.67,11.98 60.18,11.98 60.18,6.65 57.05,6.65
  pour Top (no thermals): 60.18,11.98 64.67,11.98 64.67,5.96 60.18,5.96
INA21_INN
  Bottom 0.152: C20.P$1 20.54,7 21.39,7.85 22.13,7.85 22.46,8.18 U1.5
  Bottom 0.254: R28.P$2 19.7,7 C20.P$1
INA21_INP
  Bottom 0.254: R27.P$1 19.2,7.89 19.74,8.43 20.44,8.43 | 20.44,8.43 C20.P$2 | 20.44,8.43 21.8,8.43 U1.4
LEDG
  Top 0.152: IC7.40 11.09,6.9 10.8,7.18 10.8,7.61 R2.P$1
LEDR
  Top 0.152: 10.31,6.06 R4.P$1 10.31,6.08 10.8,6.58 11.79,6.58 11.97,6.4 IC7.41
N$1
  Bottom 0.406: D1.C 26.89,3.89 26.93,3.94 27.79,3.07 R52.P$2
N$2
  Bottom 0.406: D4.C 48.19,3.56 48.19,1.26 R54.P$2
N$3
  Bottom 0.406: D3.C 37.5,3.48 R53.P$2
N$4
  Top 0.406: LED4.C R4.P$2
N$6
  Top 0.152: R21.P$2 9.19,9.16 TP2.TP
N$10
  Top 0.406: LED2.C R2.P$2
N$20
  Top 0.152: R24.P$2 8.92,4.22 TP3.TP
N$22
  Bottom 0.152: C3.P$1 14.23,4.56 IC1.4
PGND  (via drill 0.2)
  Route2 0.152: 57.51,11.53 16.52,11.53 v16.13,11.15
  Bottom 0.152: v16.13,11.15 17.05,11.15 17.35,10.84 17.35,8.56 17.96,7.95 R27.P$2
  Bottom 0.406: C26.P$2 33.65,8.91 v32.98,8.91 | C27.P$2 44.4,8.91 v43.64,8.91 | C32.P$2 54.71,8.91 v54.31,8.91
  other vias: 53.55,8 53.93,7.54 52.94,6.96 52.41,6.63 52.02,6.17 53.75,6.93 53.37,6.43 52.79,6.17 52.02,7.09 52.51,7.47 53.29,7.44 52.79,8 52.02,8 57.21,8.08 57.51,8.53 59.64,8.08 58.43,8.08 58.12,10.97 58.43,10.52 59.04,10.52 58.12,8.53 59.64,10.52 59.34,10.06 58.12,10.06 59.34,7.62 58.12,7.62 57.82,8.08 57.21,8.99 57.51,10.06 57.51,7.62 58.73,8.53 59.04,8.08 58.73,7.62 57.21,9.6 57.82,10.52 58.73,10.06 59.34,8.53 59.64,8.99 59.64,9.6 58.73,10.97 59.34,10.97 57.51,10.97 57.21,10.52 53.17,8.46 53.93,8.46 52.41,8.46 53.55,8.92 52.79,8.92 52.02,8.92 53.17,9.37 53.93,9.37 52.41,9.37 53.55,9.83 52.79,9.83 52.02,9.83 53.17,10.29 52.41,10.29 42.88,8 43.24,7.54 42.12,7.09 41.64,6.71 41.28,6.25 43.06,6.99 42.6,6.55 42.07,6.22 41.2,7.11 41.71,7.52 42.5,7.54 42.12,8 41.36,8 42.5,8.46 43.26,8.46 41.74,8.46 42.88,8.92 42.12,8.92 41.36,8.92 42.5,9.37 43.26,9.37 41.74,9.37 42.88,9.83 42.12,9.83 41.36,9.83 42.5,10.29 41.74,10.29 32.21,8 32.59,7.54 31.58,6.99 31.07,6.63 30.69,6.17 32.39,6.93 31.98,6.48 31.45,6.17 30.69,7.09 31.07,7.54 31.83,7.54 31.45,8 30.69,8 31.83,8.46 32.59,8.46 31.07,8.46 32.21,8.92 31.45,8.92 30.69,8.92 31.83,9.42 32.59,9.42 31.07,9.42 32.21,10.01 31.45,10.01 30.69,10.01
  pour Route2: 25.13,11.96 56.22,11.96 57.51,11.96 59.49,11.96 59.49,5.71 25.13,5.71
  pour Route15: 25.13,11.96 59.8,11.89 59.8,5.71 25.13,5.71
  pour Top (no thermals): 40.78,11.22 45.96,11.22 45.93,5.81 40.75,5.81
  pour Bottom: 51.42,11.98 54.69,11.98 54.69,7.41 56.6,7.41 56.6,5.96 51.42,5.96
  pour Top (no thermals): 30.11,11.22 35.3,11.22 35.26,5.81 30.08,5.81
  pour Bottom: 30.08,11.98 33.36,11.98 33.36,7.41 35.26,7.41 35.26,5.96 30.08,5.96
  pour Bottom: 40.75,11.98 44.02,11.98 44.02,7.41 45.93,7.41 45.93,5.96 40.62,6.02
  pour Top (no thermals): 51.45,11.98 59.8,11.98 59.8,5.96 51.42,5.96
  pour Bottom (no thermals): 57.05,7.31 59.8,7.31 59.83,11.22 57.09,11.22
PHASE_U  (via drill 0.2)
  Top 0.406: 28.15,2.21 Q5.3 29.98,2.21 v30.13,2.06
  Bottom 0.406: R14.P$1 27.41,9.74 v27.41,10.23 | IC2.6 34.04,6.3 32.77,6.3 31.98,5.51 31.58,5.51 31.22,5.16 31.22,4.52 30.56,3.86 30.56,3.35 29.87,2.66 C23.P$2 29.53,2.66 v30.13,2.06
  pour Top (no thermals): 25.13,12.06 29.62,12.06 29.66,0.02 25.13,0.02
PHASE_V  (via drill 0.2)
  Top 0.406: Q3.3 38.57,2.21 v38.18,2.59
  Bottom 0.406: R16.P$1 38.08,9.74 v38.08,10.23 | v38.18,2.59 39.77,2.59 C24.P$2 40.38,2.61 41.18,3.4 41.18,3.86 41.76,4.45 41.76,5.18 42.14,5.56 42.63,5.56 43.41,6.35 IC5.6 44.12,6.35
  pour Top (no thermals): 35.79,11.98 40.29,11.98 40.29,0.02 35.79,0.02
PHASE_W  (via drill 0.2)
  Top 0.406: v48.85,2.59 49.23,2.21 Q1.3
  Bottom 0.406: R18.P$1 48.75,9.74 v48.75,10.23 | v48.85,2.59 48.85,2.61 C25.P$2 51.18,2.61 51.95,3.38 51.95,3.83 52.58,4.47 52.58,5.05 53.07,5.54 53.35,5.54 54.16,6.35 IC6.6
  pour Top (no thermals): 46.46,11.98 50.96,11.98 50.99,0.02 46.46,0.02
RST  (via drill 0.2)
  Top 0.152: v16.06,3.98 16.44,3.98 17.06,3.36 IC7.7
  Bottom 0.152: C6.P$2 14.76,1.54 15.37,2.15 15.68,2.15 15.96,2.43 15.96,3.88 v16.06,3.98
RXD  (via drill 0.2)
  Top 0.152: v11.28,7.39 11.28,8.19 R21.P$1 | IC7.43 11.98,5.4 11.64,5.74 v11.33,5.74
  Bottom 0.152: v11.33,5.74 11.64,6.04 11.64,7.03 v11.28,7.39
TCK/SWCLK  (via drill 0.2)
  Top 0.152: TP12.TP 10.72,10.31 12.56,8.47 IC7.37
  other vias: 10.72,10.84
TDO/TRACESWO  (via drill 0.2)
  Top 0.152: IC7.39 11.96,7.4 11.66,7.69 11.66,8.91 10.72,9.85 10.34,9.85 TP13.TP
  other vias: 9.35,10.84
TMS/SWDIO  (via drill 0.2)
  Top 0.152: IC7.34 15.06,10.7 14.46,11.3 12.55,11.3 TP11.TP
  other vias: 12.1,10.84
TXD
  Top 0.152: R24.P$1 10.8,4.32 10.8,6.04 11.03,6.27 11.56,6.27 11.94,5.89 IC7.42
U_!DIS  (via drill 0.2)
  Top 0.152: IC7.26 19.06,8.98 v19.26,8.78
  Bottom 0.152: v19.26,8.78 19.26,10.23 20.02,10.99 28.02,10.99 28.4,10.61 R8.P$1
U_GATE_HIGH
  Bottom 0.406: R50.P$2 35.57,3.4 35.57,4.22 34.7,5.08 IC2.7
U_GATE_HIGH_T  (via drill 0.2)
  Top 0.406: Q5.4 29.23,0.51 30.31,0.51 v30.31,0.61
  Bottom 0.406: v30.31,0.61 30.41,0.51 34.18,0.51 R50.P$1
U_GATE_LOW
  Bottom 0.406: 29.47,7.62 IC2.4 29.67,7.62 29.67,8.85 R51.P$2
U_GATE_LOW_T  (via drill 0.2)
  Top 0.406: v33.05,10.23 34.33,10.23 Q6.4
  Bottom 0.406: R51.P$1 30.11,10.74 32.57,10.74 33.05,10.26 v33.05,10.23
U_PWM  (via drill 0.2)
  Top 0.152: IC7.29 17.56,10.52 18.04,10.99 24.59,10.99 v25.36,10.23
  Bottom 0.152: v25.36,10.23 25.51,10.08 25.51,5.37 R5.P$2
U_PWM_IN
  Bottom 0.152: IC2.1 28,3.81 27.34,4.47 27.34,4.62 27.23,4.72 25.89,4.72 24.93,3.76 R5.P$1
U_SD
  Bottom 0.152: R8.P$2 27.82,8.08 27.82,5.82 28.55,5.08 IC2.2
U_VB
  Bottom 0.406: IC2.8 33.89,3.81 33.86,1.6 33.38,1.12 30.87,1.12 30.74,1.25 29.2,1.25 C23.P$1 28.64,1.63 R52.P$1
U_VOLTAGE  (via drill 0.2)
  Top 0.152: IC7.10 18.56,2.35 v18.64,2.42
  Route15 0.152: v26.73,10.23 26.73,10.31 26.04,10.99 25.28,10.99 24.75,10.46 v24.75,0.78
  Bottom 0.152: R14.P$2 26.73,8.66 | 26.73,8.66 R15.P$1 | v26.73,10.23 26.73,8.66 | v18.64,2.42 18.64,1.48 19.49,0.63 24.59,0.63 v24.75,0.78
USART_+5V
  Top 0.406: D2.A 8.05,0.87 TP4.TP
V_!DIS  (via drill 0.2)
  Top 0.152: IC7.27 18.56,8.8 v18.57,8.78
  Bottom 0.152: v18.57,8.78 18.57,10.23 19.64,11.3 38.61,11.3 39.07,10.84 R9.P$1
V_BATT  (via drill 0.2)
  Top 0.152: IC7.13 21.06,2.18 v21.39,1.85
  Bottom 0.152: v21.39,1.85 21.93,2.38 22.76,2.38 22.92,2.54 25.74,2.54 25.91,2.36 25.91,2.21 26.47,1.66 R13.P$2 26.49,1.63
  Bottom 0.305: R12.P$1 27.26,0.63 26.98,0.91 26.98,1.12 R13.P$2
V_GATE_HIGH
  Bottom 0.406: IC5.7 45.24,5.08 46.11,4.22 46.11,3.37 45.65,2.91 R48.P$2
V_GATE_HIGH_T  (via drill 0.2)
  Top 0.406: 39.55,0.86 Q3.4 39.47,0.61 v40.77,0.61
  Bottom 0.406: 45.46,1.16 R48.P$1 45.05,0.56 40.82,0.56 v40.77,0.61
V_GATE_LOW
  Bottom 0.406: 40.31,7.62 IC5.4 40.39,7.62 R49.P$2
V_GATE_LOW_T  (via drill 0.2)
  Top 0.406: v43.72,10.23 44.99,10.23 Q4.4
  Bottom 0.406: v43.72,10.23 43.03,10.92 40.88,10.92 R49.P$1
V_IN  (via drill 0.2)
  Top 0.406: D2.C v10.04,1.62
  Route15 0.406: v15.68,6.27 v15.68,5.66 v15.68,5.05 15.45,4.82 15.45,2.61 | v10.04,1.62 10.42,1.24 12.71,1.24 13.09,1.62 14.46,1.62 15.45,2.61 | v22.92,1.85 22.23,1.16 16.9,1.16 15.45,2.61
  Bottom 0.406: C2.P$1 17.17,6.8 IC1.1 16.02,6.61 v15.68,6.27 v15.68,5.66 v15.68,5.05 16.02,4.71 IC1.3 17.24,4.45 C1.+ | J3.P$1 24.38,2.08 23.22,2.08 22.99,1.85 v22.92,1.85 | TP8.TP v10.04,1.62
V_PWM  (via drill 0.2)
  Top 0.152: IC7.30 17.06,10.47 17.89,11.3 35.19,11.3 35.95,10.54 v35.95,10.23
  Bottom 0.152: v35.95,10.23 36.07,10.11 36.07,5.54 35.69,5.16 35.69,4.8 36.05,4.45 36.05,2.53 R6.P$2
V_PWM_IN
  Bottom 0.152: R6.P$1 36.34,1.46 36.84,1.96 36.84,2.64 36.38,3.1 36.38,4.24 36.61,4.47 37.93,4.47 38.13,4.27 38.13,4.09 38.41,3.81 IC5.1
V_SD
  Bottom 0.152: R9.P$2 38.41,8.01 38.41,5.54 38.87,5.08 IC5.2
V_VB
  Bottom 0.406: IC5.8 44.66,1.68 44.12,1.14 41.23,1.14 41.15,1.22 40.31,1.22 40.2,1.11 C24.P$1 | C24.P$1 39.77,1.11 | C24.P$1 39.78,1.07 39.83,1.02 | R53.P$1 39.34,1.55 C24.P$1
V_VOLTAGE  (via drill 0.2)
  Top 0.152: IC7.11 19.06,2.19 v19.3,2.42
  Route15 0.152: v37.39,10.23 37.39,10.31 36.4,11.3 25.13,11.3 24.44,10.61 24.44,1.47 v24.14,1.16
  Bottom 0.152: R16.P$2 37.39,9.28 | 37.39,9.28 v37.39,10.23 | R17.P$1 37.39,9.28 | v19.3,2.42 19.3,1.43 19.79,0.94 23.91,0.94 v24.14,1.16
VDDA  (via drill 0.2)
  Top 0.305: IC7.9 18.06,2.74 18.46,3.15 v18.88,3.15
  Bottom 0.305: v18.88,3.15 18.46,3.15 18.03,2.71 L8.P$1
  Bottom 0.406: C7.P$1 18.88,3.71 | 18.88,3.71 C8.P$1 | v18.88,3.15 18.88,3.71
W_!DIS  (via drill 0.2)
  Top 0.152: IC7.28 18.06,8.96 v17.89,8.78
  Bottom 0.152: v17.89,8.78 17.89,10.23 19.26,11.6 49.13,11.6 49.74,10.99 R10.P$1
W_GATE_HIGH
  Bottom 0.406: IC6.7 56.04,5.08 56.9,4.22 56.9,3.38 56.15,2.63 R46.P$2
W_GATE_HIGH_T  (via drill 0.2)
  Top 0.406: v51.44,0.61 50.47,0.61 Q1.4
  Bottom 0.406: 56.09,1.06 R46.P$1 55.51,0.56 51.49,0.56 v51.44,0.61
W_GATE_LOW
  Bottom 0.406: 50.98,7.62 IC6.4 51.03,7.62 R47.P$2
W_GATE_LOW_T  (via drill 0.2)
  Top 0.406: v54.39,10.23 55.66,10.23 Q2.4
  Bottom 0.406: v54.39,10.23 53.7,10.92 51.5,10.92 R47.P$1
W_PWM  (via drill 0.2)
  Top 0.152: IC7.31 16.56,10.51 17.66,11.6 45.55,11.6 46.69,10.46 v46.69,10.23
  Bottom 0.152: v46.69,10.23 46.82,10.11 46.82,4.98 46.69,4.85 46.69,2.73 R7.P$2
W_PWM_IN
  Bottom 0.152: IC6.1 49.38,3.81 48.62,4.57 47.2,4.57 47.05,4.42 47.05,3.28 47.63,2.69 47.63,1.97 R7.P$1
W_SD
  Bottom 0.152: R10.P$2 49.66,8.59 49.66,8.43 49.18,7.95 49.18,5.87 49.97,5.08 IC6.2
W_VB
  Bottom 0.406: IC6.8 55.45,3.65 55.1,3.3 55.1,1.5 55.05,1.5 54.69,1.14 51.92,1.14 51.77,1.29 51.03,1.29 50.85,1.11 C25.P$1 50.36,1.17 R54.P$1
W_VOLTAGE  (via drill 0.2)
  Top 0.152: IC7.12 19.56,1.92 v20.06,2.42
  Route15 0.152: v48.06,10.23 48.06,10.31 46.77,11.6 24.97,11.6 24.14,10.77 24.14,2.08 v23.53,1.47
  Bottom 0.152: R18.P$2 48.06,9.28 | 48.06,9.28 v48.06,10.23 | R22.P$1 48.06,9.28 | v20.06,2.42 20.06,1.43 20.25,1.24 23.3,1.24 v23.53,1.47

### Text on the board
tPlace: U | V | W | STRIP | CCBYSA | + | V0.2 | OBLDC
bPlace: J2 | J1 | - | STRIP | OBLDC | J3 | CCBYSA | C12PET